# Altium project BatteryChargerSwitch.PrjPcb
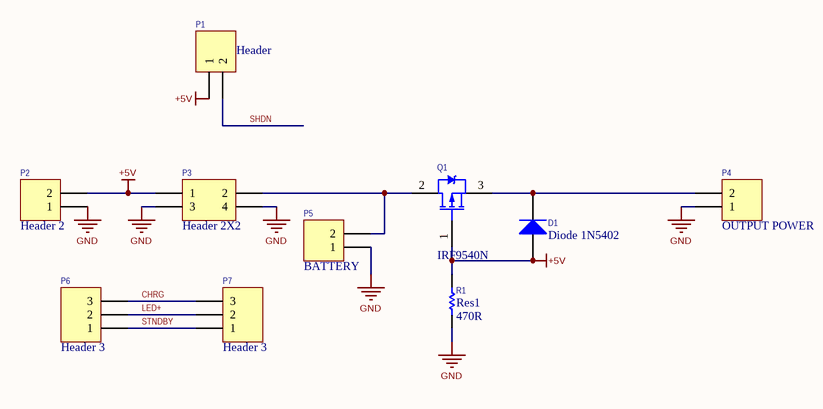
[diagram p0: BatteryChargerSwitch.SchDoc]
1 sheet, 10 parts. Net scope: global (net labels, ports and power ports of the same name join across sheets).
Board file: BatteryChargerSwitch.PcbDoc

## Sheet BatteryChargerSwitch.SchDoc
size A4

### Parts
D1  Diode 1N5402  [1N5408 DO-201AD]
P1  Header  [KF301 2PIN]
P2  Header 2  [KF301 2PIN]
P3  Header 2X2  [TP5100_MODULE]
P4  OUTPUT POWER  [KF301 2PIN]
P5  BATTERY  [KF301 2PIN]
P6  Header 3  [HDR1X3]
P7  Header 3  [HDR1X3]
Q1  IRF9540N  [TO-220 AB]
R1  Res1  value 470R  [Axial 0_25 W, 0_4 IN LEAD PITCH]

### Nets
+5V: D1.1(A) P1.1 P2.2 P3.1 Q1.1(G) R1.2
GND: P2.1 P3.3 P3.4 P4.1 P5.1 R1.1
CHRG: P6.3 P7.3
LED+: P6.2 P7.2
SHDN: P1.2
STNDBY: P6.1 P7.1
NetD1_2: D1.2(K) P4.2 Q1.3(S)
NetP3_2: P3.2 P5.2 Q1.2(D)

### Library data of the parts
D1 = Diode 1N5402: 3 Amp General Purpose Rectifier; Published: 8-Jun-2000; LatestRevisionDate: 17-Jul-2002; LatestRevisionNote: Re-released for DXP Platform.; DatasheetVersion: 1998; PackageVersion: Aug-1999; PackageReference: DO-201AD; Publisher: Altium Limited; PackageDescription: Diode, Axial; Body 9.5 x 5.6 mm (LxDia. max), Lead Dia. 1.32 mm (max); ComponentLink1Description: Manufacturer Link; ComponentLink1URL: http://www.fairchildsemi.com/; ComponentLink2Description: Datasheet; ComponentLink2URL: http://www.fairchildsemi.com/ds/1N%2F1N5400.pdf
P1 P2 P4 P5 = Header 2: Header, 2-Pin; LatestRevisionDate: 17-Jul-2002; LatestRevisionNote: Re-released for DXP Platform.; Publisher: Altium Limited
P3 = Header 2X2: Header, 2-Pin, Dual row; LatestRevisionDate: 17-Jul-2002; LatestRevisionNote: Re-released for DXP Platform.; Publisher: Altium Limited
P6 P7 = Header 3: Header, 3-Pin; LatestRevisionDate: 17-Jul-2002; LatestRevisionNote: Re-released for DXP Platform.; Publisher: Altium Limited
Q1 = IRF9540N: HEXFET Power MOSFET; Note: Pin 2 is electrically connected to pin 4.; Published: 8-Jun-2000; LatestRevisionDate: 17-Jul-2002; LatestRevisionNote: Re-released for DXP Platform.; DatasheetVersion: May-1998; PackageVersion: Feb-1997; PackageReference: TO-220AB; Publisher: Altium Limited; PackageDescription: TO, Thru-Hole, Vertical, Heatsink Mounted; 3 In-Line Leads; Pitch 2.54 mm; ComponentLink1Description: Manufacturer Link; ComponentLink1URL: http://www.irf.com/; ComponentLink2Description: Datasheet; ComponentLink2URL: http://www.irf.com/product-info/datasheets/data/irf9540n.pdf
R1 = Res1: Resistor; Published: 8-Jun-2000; LatestRevisionDate: 17-Jul-2002; LatestRevisionNote: Re-released for DXP Platform.; PackageReference: AXIAL-0.3; Publisher: Altium Limited; PackageDescription: Axial Device, Thru-Hole; 2 Leads; 0.3 in Pin Spacing